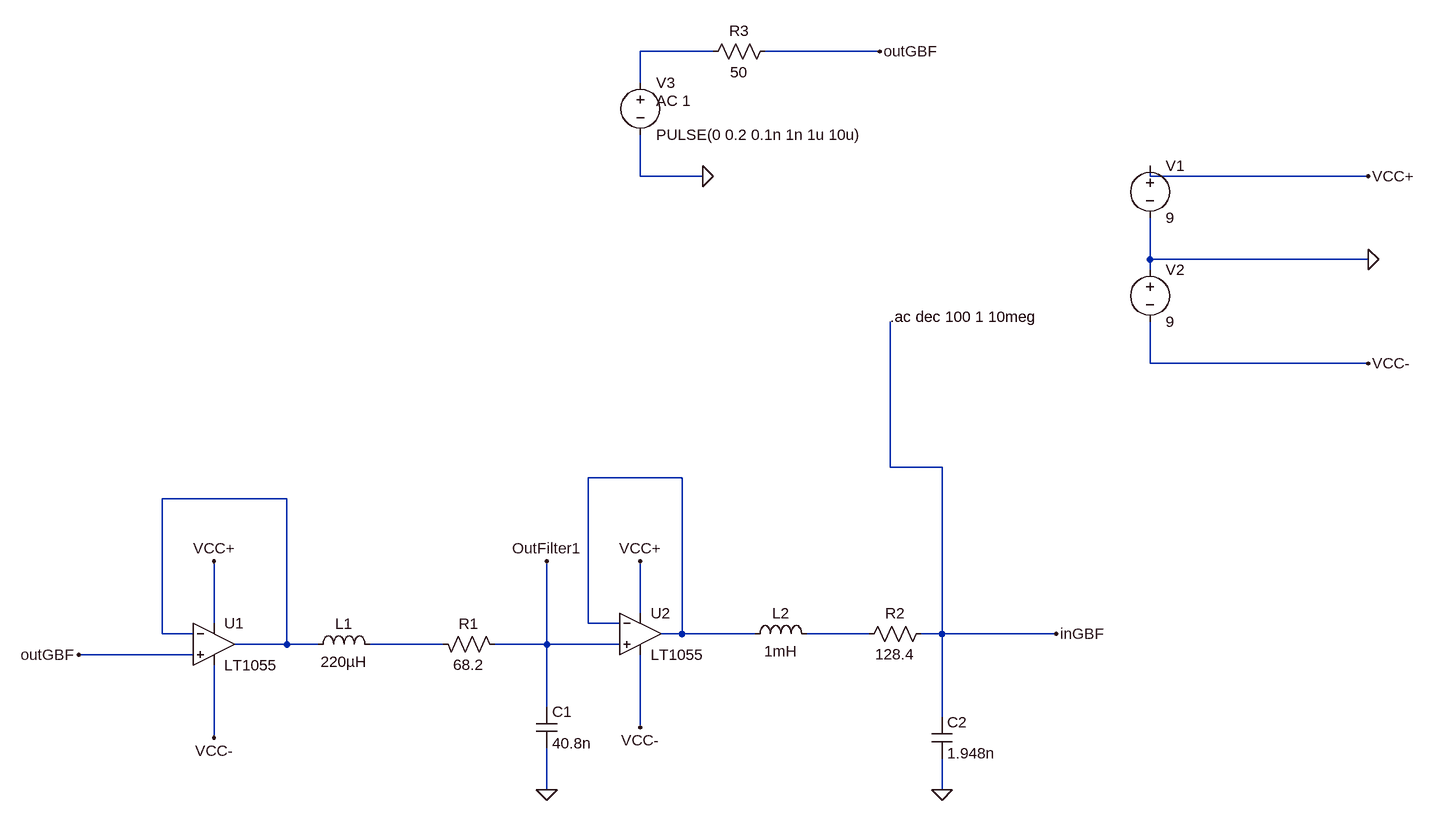
[diagram p0: schematic Cablage.asc]
Cablage.asc, the LTspice schematic file:
Version 4
SHEET 1 1232 680
WIRE 144 -896 32 -896
WIRE 400 -896 224 -896
WIRE 32 -848 32 -896
WIRE 32 -704 32 -768
WIRE 128 -704 32 -704
WIRE 816 -704 816 -720
WIRE 1152 -704 816 -704
WIRE 816 -576 816 -640
WIRE 1152 -576 816 -576
WIRE 816 -560 816 -576
WIRE 816 -416 816 -480
WIRE 1152 -416 816 -416
WIRE 416 -256 416 -480
WIRE 496 -256 416 -256
WIRE 96 -240 -48 -240
WIRE -512 -208 -704 -208
WIRE 32 -32 32 -112
WIRE -624 -16 -624 -112
WIRE -48 -16 -48 -240
WIRE 0 -16 -48 -16
WIRE -704 0 -704 -208
WIRE -656 0 -704 0
WIRE 96 0 96 -240
WIRE 96 0 64 0
WIRE 208 0 96 0
WIRE 384 0 288 0
WIRE 496 0 496 -256
WIRE 496 0 464 0
WIRE 672 0 496 0
WIRE -512 16 -512 -208
WIRE -512 16 -592 16
WIRE -464 16 -512 16
WIRE -272 16 -384 16
WIRE -112 16 -112 -112
WIRE -112 16 -192 16
WIRE 0 16 -112 16
WIRE -656 32 -832 32
WIRE -112 112 -112 16
WIRE 496 128 496 0
WIRE 32 144 32 32
WIRE -624 160 -624 48
WIRE -112 240 -112 176
WIRE 496 240 496 192
FLAG -624 -112 VCC+
FLAG 32 -112 VCC+
FLAG -112 240 0
FLAG 496 240 0
FLAG -624 160 VCC-
FLAG 32 144 VCC-
FLAG -832 32 outGBF
FLAG -112 -112 OutFilter1
FLAG 672 0 inGBF
FLAG 1152 -704 VCC+
FLAG 1152 -416 VCC-
FLAG 1152 -576 0
FLAG 128 -704 0
FLAG 400 -896 outGBF
SYMBOL OpAmps\\LT1055 -624 -48 R0
SYMATTR InstName U1
SYMBOL OpAmps\\LT1055 32 -64 R0
SYMATTR InstName U2
SYMBOL ind -480 32 R270
WINDOW 0 32 56 VTop 2
WINDOW 3 5 56 VBottom 2
SYMATTR InstName L1
SYMATTR Value 220µH
SYMBOL ind 192 16 R270
WINDOW 0 32 56 VTop 2
WINDOW 3 5 56 VBottom 2
SYMATTR InstName L2
SYMATTR Value 1mH
SYMBOL res -176 32 M270
WINDOW 0 32 56 VTop 2
WINDOW 3 0 56 VBottom 2
SYMATTR InstName R1
SYMATTR Value 68.2
SYMBOL res 368 16 R270
WINDOW 0 32 56 VTop 2
WINDOW 3 0 56 VBottom 2
SYMATTR InstName R2
SYMATTR Value 128.4
SYMBOL cap -128 112 R0
SYMATTR InstName C1
SYMATTR Value 40.8n
SYMBOL cap 480 128 R0
SYMATTR InstName C2
SYMATTR Value 1.948n
SYMBOL voltage 816 -736 R0
WINDOW 123 0 0 Left 0
WINDOW 39 0 0 Left 0
SYMATTR InstName V1
SYMATTR Value 9
SYMBOL voltage 816 -576 R0
WINDOW 123 0 0 Left 0
WINDOW 39 0 0 Left 0
SYMATTR InstName V2
SYMATTR Value 9
SYMBOL voltage 32 -864 R0
WINDOW 123 24 44 Left 2
WINDOW 39 0 0 Left 0
SYMATTR Value2 AC 1
SYMATTR InstName V3
SYMATTR Value PULSE(0 0.2 0.1n 1n 1u 10u)
SYMBOL res 240 -912 R90
WINDOW 0 0 56 VBottom 2
WINDOW 3 32 56 VTop 2
SYMATTR InstName R3
SYMATTR Value 50
TEXT 416 -488 Left 2 !.ac dec 100 1 10meg

The netlist it stands for:
* Cablage.asc
XU1 outGBF N003 VCC+ VCC- N003 LT1055  ; pins In+ In- V+ V- OUT
XU2 OutFilter1 N002 VCC+ VCC- N002 LT1055  ; pins In+ In- V+ V- OUT
L1 N003 N005 220µH
L2 N002 N004 1mH
R1 OutFilter1 N005 68.2
R2 N004 inGBF 128.4
C1 OutFilter1 0 40.8n
C2 inGBF 0 1.948n
V1 VCC+ 0 9
V2 0 VCC- 9
V3 N001 0 PULSE(0 0.2 0.1n 1n 1u 10u) AC 1
R3 outGBF N001 50
.ac dec 100 1 10meg
.backanno
.end

* Results of the author's LTspice run, read from the files saved beside the schematic
* Operating Point, zero values left out:
*   V(vcc+) = 9 V
*   V(vcc-) = -9 V
*   I(V2) = -5.6 mA
*   I(V1) = -5.6 mA
*   Ix(u1:3) = 2.8 mA
*   Ix(u1:4) = -2.8 mA
*   Ix(u2:3) = 2.8 mA
*   Ix(u2:4) = -2.8 mA
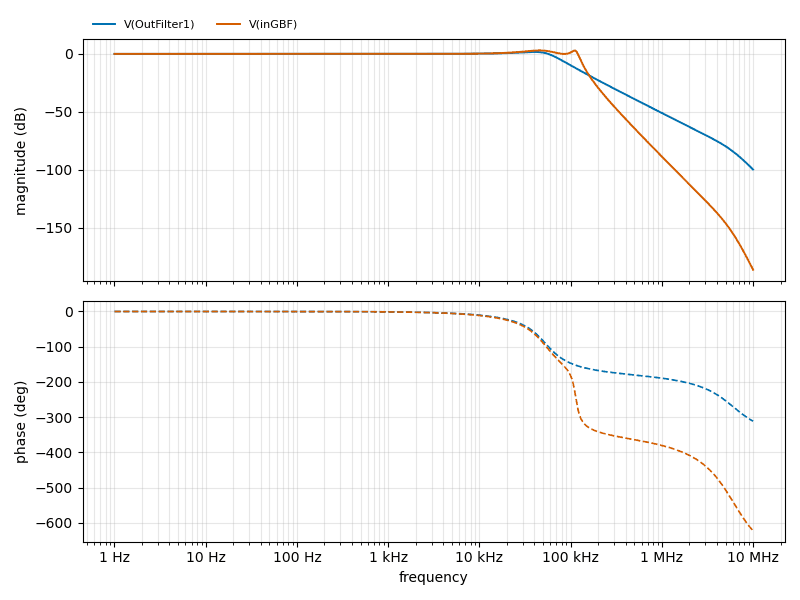
[diagram p1: AC Analysis of Cablage.asc, plotted from the saved traces]
* AC Analysis, 1 run:
*   V(OutFilter1): -0.00 dB at 1 Hz, -99.67 dB at 10 MHz, peak 1.71 dB at 39.81 kHz, 3 dB below the peak at 62.53 kHz
*   V(inGBF): -0.00 dB at 1 Hz, -186.06 dB at 10 MHz, peak 3.01 dB at 45.71 kHz, 3 dB below the peak at 893.5 Hz and 82.75 kHz